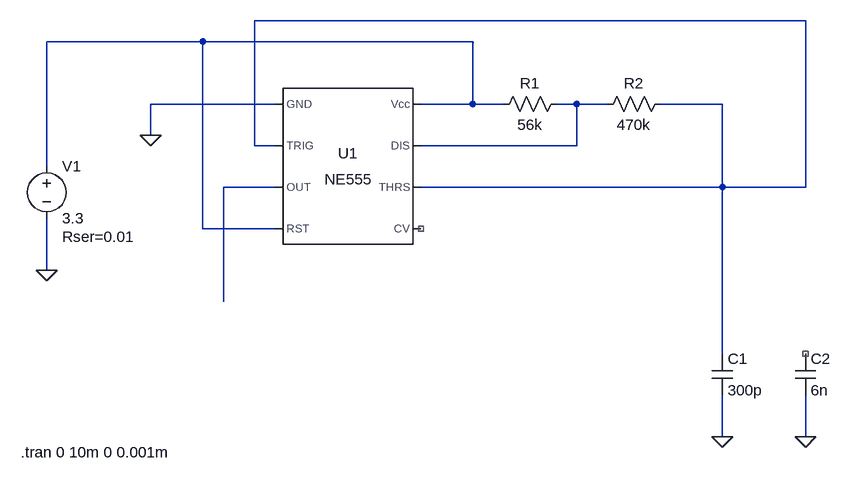
[diagram p0: schematic Draft2.asc]
Draft2.asc, the LTspice schematic file:
Version 4
SHEET 1 1288 680
WIRE 1248 -128 400 -128
WIRE 320 -96 80 -96
WIRE 736 -96 320 -96
WIRE 432 0 240 0
WIRE 736 0 736 -96
WIRE 736 0 656 0
WIRE 784 0 736 0
WIRE 896 0 864 0
WIRE 944 0 896 0
WIRE 1120 0 1024 0
WIRE 240 48 240 0
WIRE 400 64 400 -128
WIRE 432 64 400 64
WIRE 896 64 896 0
WIRE 896 64 656 64
WIRE 80 96 80 -96
WIRE 432 128 352 128
WIRE 1120 128 1120 0
WIRE 1120 128 656 128
WIRE 1248 128 1248 -128
WIRE 1248 128 1120 128
WIRE 320 192 320 -96
WIRE 432 192 320 192
WIRE 80 256 80 176
WIRE 352 304 352 128
WIRE 1120 384 1120 128
WIRE 1120 512 1120 448
WIRE 1248 512 1248 448
FLAG 80 256 0
FLAG 1120 512 0
FLAG 1248 512 0
FLAG 240 48 0
SYMBOL voltage 80 80 R0
WINDOW 123 0 0 Left 0
WINDOW 39 24 124 Left 2
SYMATTR SpiceLine Rser=0.01
SYMATTR InstName V1
SYMATTR Value 3.3
SYMBOL Misc\\NE555 544 96 R0
SYMATTR InstName U1
SYMBOL res 880 -16 R90
WINDOW 0 0 56 VBottom 2
WINDOW 3 32 56 VTop 2
SYMATTR InstName R1
SYMATTR Value 56k
SYMATTR SpiceLine tol=1
SYMBOL res 1040 -16 R90
WINDOW 0 0 56 VBottom 2
WINDOW 3 32 56 VTop 2
SYMATTR InstName R2
SYMATTR Value 470k
SYMBOL cap 1104 384 R0
SYMATTR InstName C1
SYMATTR Value 300p
SYMBOL cap 1232 384 R0
SYMATTR InstName C2
SYMATTR Value 6n
TEXT 40 536 Left 2 !.tran 0 10m 0 0.001m

The netlist it stands for:
* Draft2.asc
V1 N002 0 3.3 Rser=0.01
XU1 0 N001 N004 N002 NC_01 N001 N003 N002 NE555  ; pins GND TRIG OUT RST CV THRS DIS Vcc
R1 N003 N002 56k tol=1
R2 N001 N003 470k
C1 N001 0 300p
C2 NC_02 0 6n
.tran 0 10m 0 0.001m
.lib NE555.sub
.backanno
.end